# Altium project HabitSunrise.PrjPcb
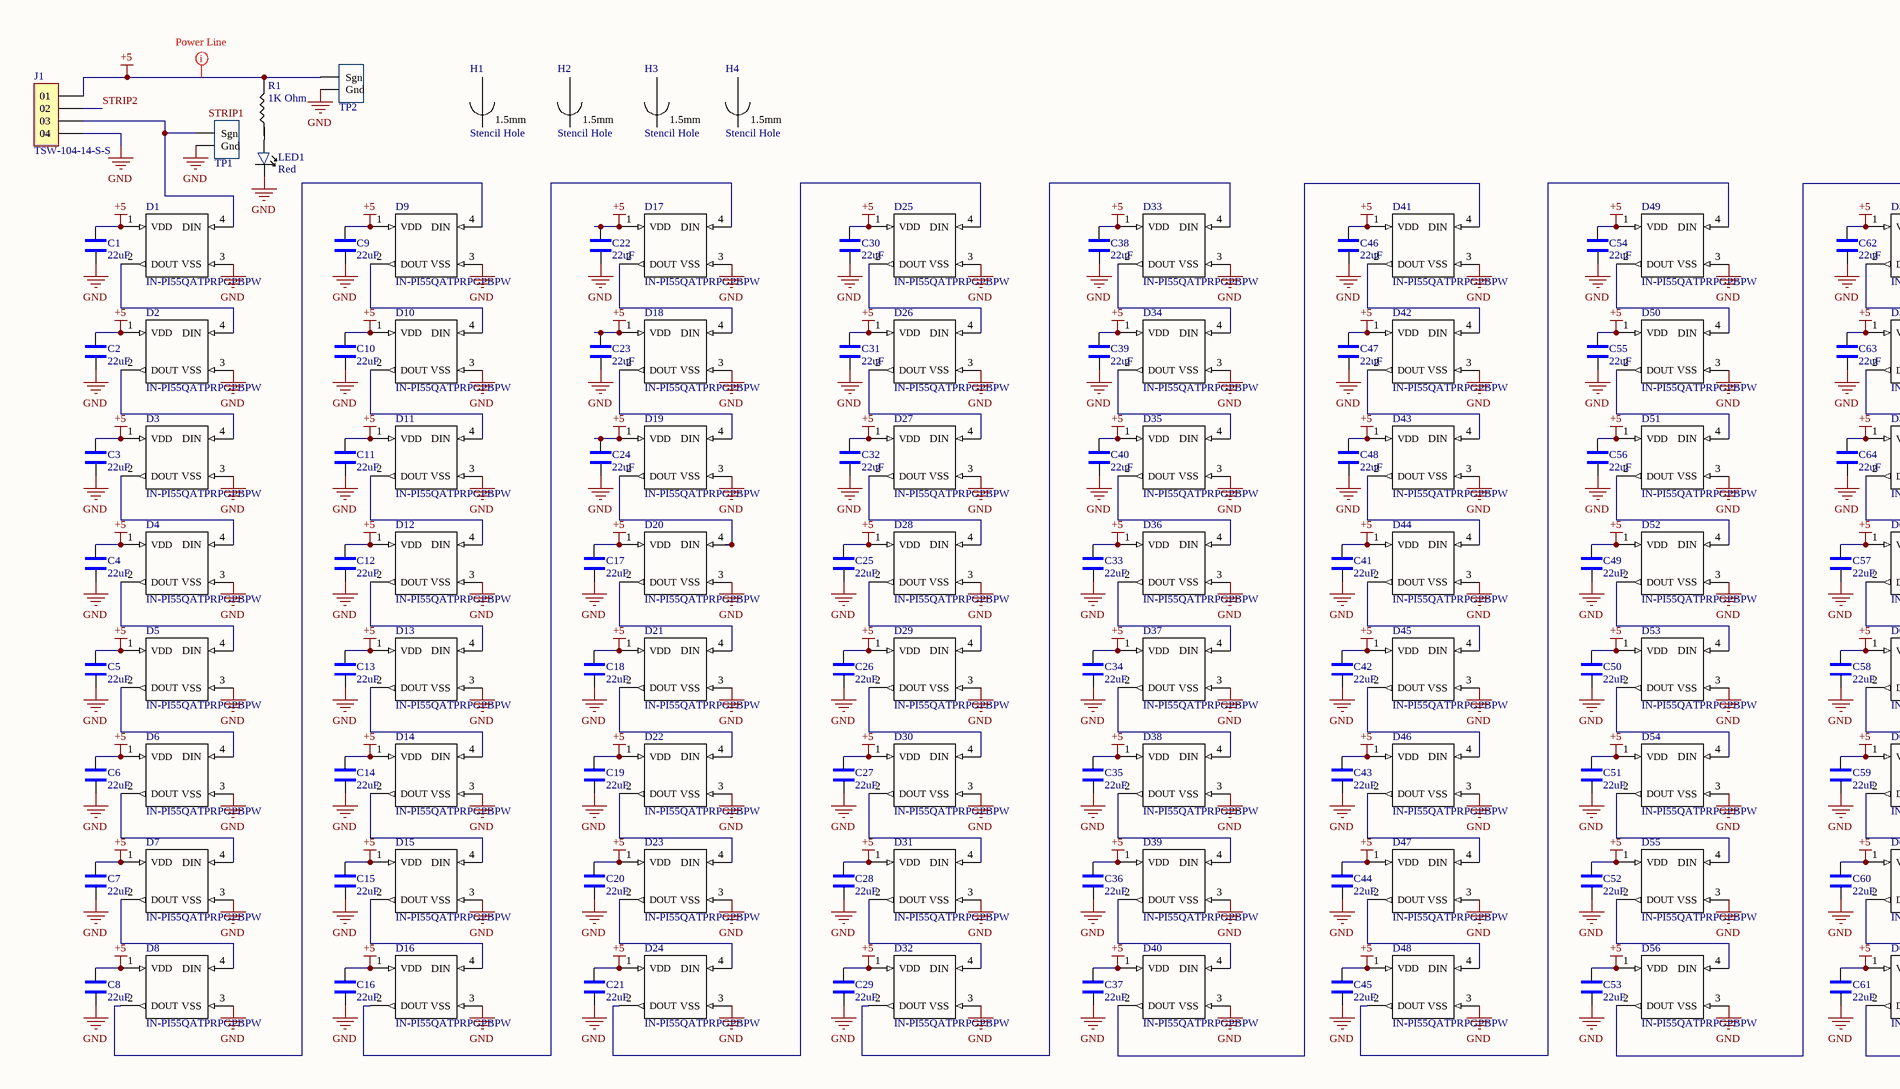
[diagram p0: SmartLEDS.SchDoc, left]
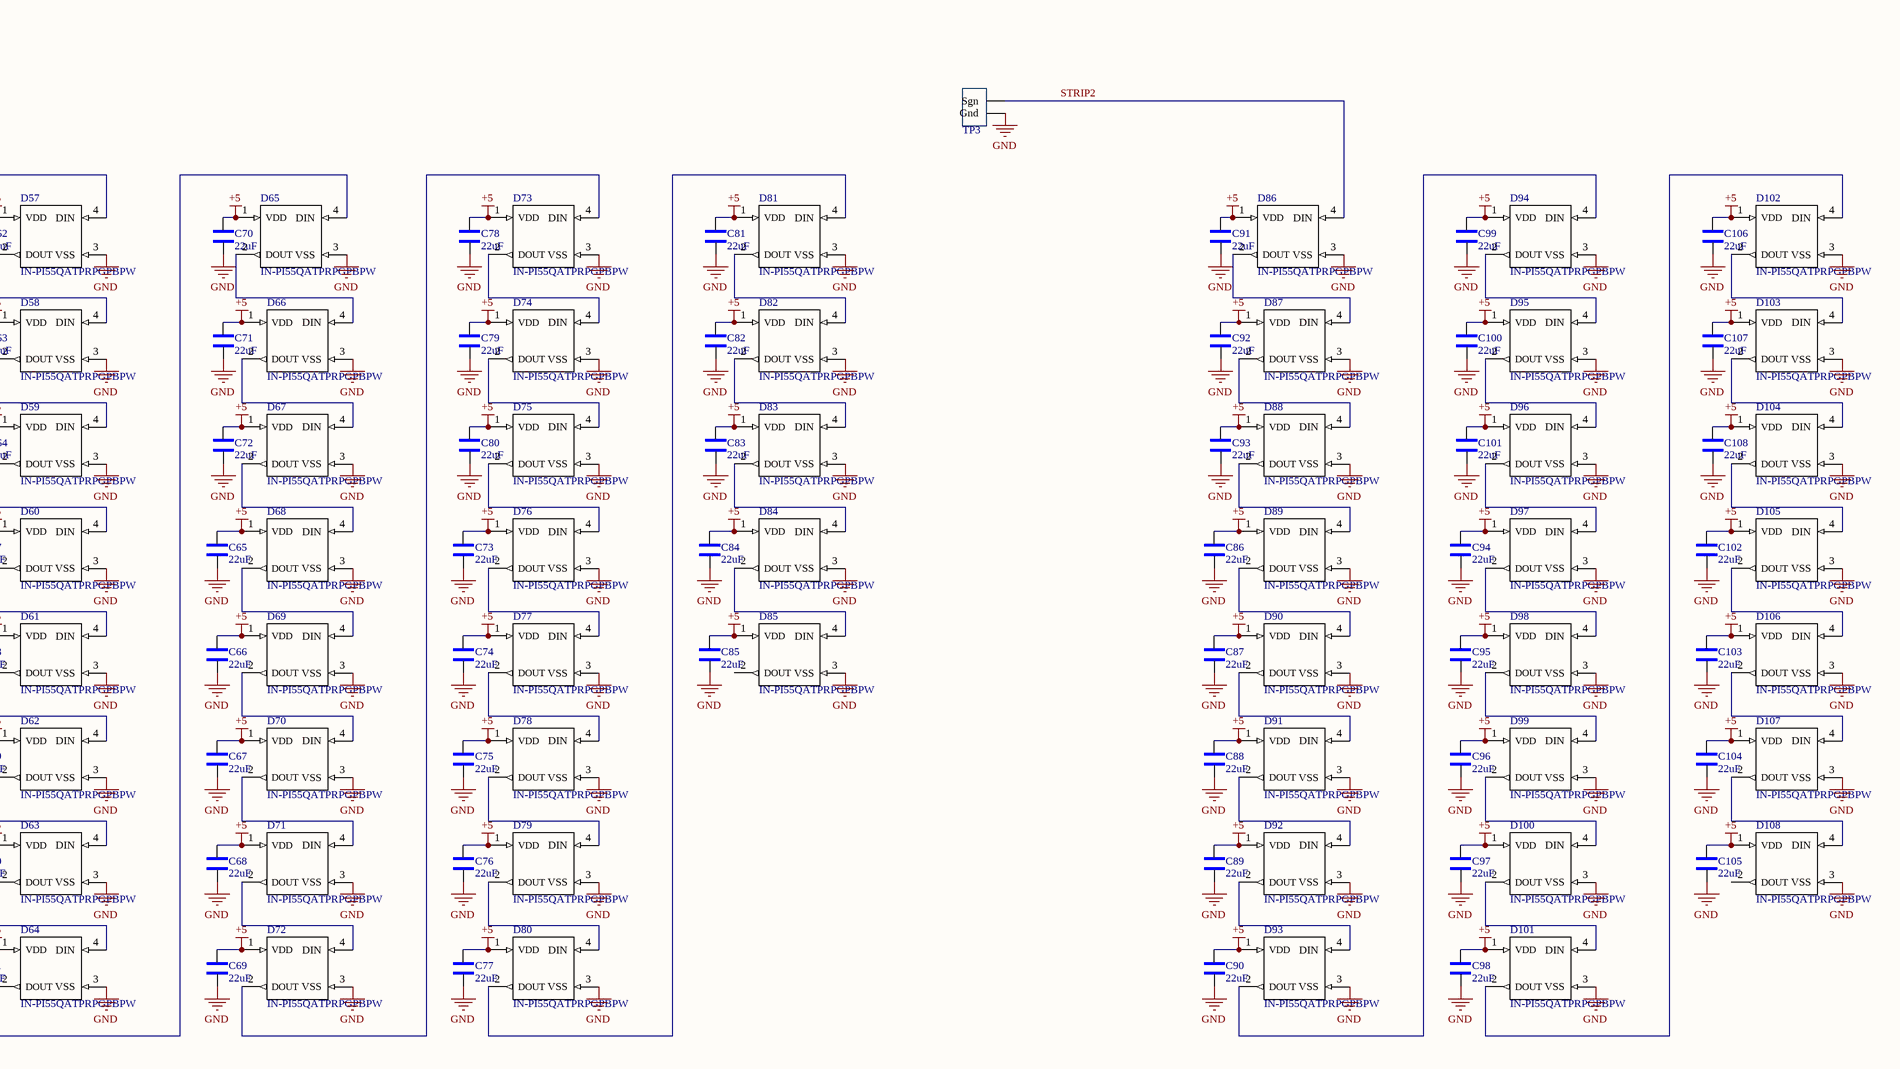
[diagram p1: SmartLEDS.SchDoc, right]
1 sheet, 226 parts. Net scope: global (net labels, ports and power ports of the same name join across sheets).
Board file: LED.PcbDoc

## Sheet SmartLEDS.SchDoc
size 1143 x 241 mm; SheetNumber: 1; SheetTotal: 1

### Parts
C1  22uF  [1206_Passive_Capacitor]
C2  22uF  [1206_Passive_Capacitor]
C3  22uF  [1206_Passive_Capacitor]
C4  22uF  [1206_Passive_Capacitor]
C5  22uF  [1206_Passive_Capacitor]
C6  22uF  [1206_Passive_Capacitor]
C7  22uF  [1206_Passive_Capacitor]
C8  22uF  [1206_Passive_Capacitor]
C9  22uF  [1206_Passive_Capacitor]
C10  22uF  [1206_Passive_Capacitor]
C11  22uF  [1206_Passive_Capacitor]
C12  22uF  [1206_Passive_Capacitor]
C13  22uF  [1206_Passive_Capacitor]
C14  22uF  [1206_Passive_Capacitor]
C15  22uF  [1206_Passive_Capacitor]
C16  22uF  [1206_Passive_Capacitor]
C17  22uF  [1206_Passive_Capacitor]
C18  22uF  [1206_Passive_Capacitor]
C19  22uF  [1206_Passive_Capacitor]
C20  22uF  [1206_Passive_Capacitor]
C21  22uF  [1206_Passive_Capacitor]
C22  22uF  [1206_Passive_Capacitor]
C23  22uF  [1206_Passive_Capacitor]
C24  22uF  [1206_Passive_Capacitor]
C25  22uF  [1206_Passive_Capacitor]
C26  22uF  [1206_Passive_Capacitor]
C27  22uF  [1206_Passive_Capacitor]
C28  22uF  [1206_Passive_Capacitor]
C29  22uF  [1206_Passive_Capacitor]
C30  22uF  [1206_Passive_Capacitor]
C31  22uF  [1206_Passive_Capacitor]
C32  22uF  [1206_Passive_Capacitor]
C33  22uF  [1206_Passive_Capacitor]
C34  22uF  [1206_Passive_Capacitor]
C35  22uF  [1206_Passive_Capacitor]
C36  22uF  [1206_Passive_Capacitor]
C37  22uF  [1206_Passive_Capacitor]
C38  22uF  [1206_Passive_Capacitor]
C39  22uF  [1206_Passive_Capacitor]
C40  22uF  [1206_Passive_Capacitor]
C41  22uF  [1206_Passive_Capacitor]
C42  22uF  [1206_Passive_Capacitor]
C43  22uF  [1206_Passive_Capacitor]
C44  22uF  [1206_Passive_Capacitor]
C45  22uF  [1206_Passive_Capacitor]
C46  22uF  [1206_Passive_Capacitor]
C47  22uF  [1206_Passive_Capacitor]
C48  22uF  [1206_Passive_Capacitor]
C49  22uF  [1206_Passive_Capacitor]
C50  22uF  [1206_Passive_Capacitor]
C51  22uF  [1206_Passive_Capacitor]
C52  22uF  [1206_Passive_Capacitor]
C53  22uF  [1206_Passive_Capacitor]
C54  22uF  [1206_Passive_Capacitor]
C55  22uF  [1206_Passive_Capacitor]
C56  22uF  [1206_Passive_Capacitor]
C57  22uF  [1206_Passive_Capacitor]
C58  22uF  [1206_Passive_Capacitor]
C59  22uF  [1206_Passive_Capacitor]
C60  22uF  [1206_Passive_Capacitor]
C61  22uF  [1206_Passive_Capacitor]
C62  22uF  [1206_Passive_Capacitor]
C63  22uF  [1206_Passive_Capacitor]
C64  22uF  [1206_Passive_Capacitor]
C65  22uF  [1206_Passive_Capacitor]
C66  22uF  [1206_Passive_Capacitor]
C67  22uF  [1206_Passive_Capacitor]
C68  22uF  [1206_Passive_Capacitor]
C69  22uF  [1206_Passive_Capacitor]
C70  22uF  [1206_Passive_Capacitor]
C71  22uF  [1206_Passive_Capacitor]
C72  22uF  [1206_Passive_Capacitor]
C73  22uF  [1206_Passive_Capacitor]
C74  22uF  [1206_Passive_Capacitor]
C75  22uF  [1206_Passive_Capacitor]
C76  22uF  [1206_Passive_Capacitor]
C77  22uF  [1206_Passive_Capacitor]
C78  22uF  [1206_Passive_Capacitor]
C79  22uF  [1206_Passive_Capacitor]
C80  22uF  [1206_Passive_Capacitor]
C81  22uF  [1206_Passive_Capacitor]
C82  22uF  [1206_Passive_Capacitor]
C83  22uF  [1206_Passive_Capacitor]
C84  22uF  [1206_Passive_Capacitor]
C85  22uF  [1206_Passive_Capacitor]
C86  22uF  [1206_Passive_Capacitor]
C87  22uF  [1206_Passive_Capacitor]
C88  22uF  [1206_Passive_Capacitor]
C89  22uF  [1206_Passive_Capacitor]
C90  22uF  [1206_Passive_Capacitor]
C91  22uF  [1206_Passive_Capacitor]
C92  22uF  [1206_Passive_Capacitor]
C93  22uF  [1206_Passive_Capacitor]
C94  22uF  [1206_Passive_Capacitor]
C95  22uF  [1206_Passive_Capacitor]
C96  22uF  [1206_Passive_Capacitor]
C97  22uF  [1206_Passive_Capacitor]
C98  22uF  [1206_Passive_Capacitor]
C99  22uF  [1206_Passive_Capacitor]
C100  22uF  [1206_Passive_Capacitor]
C101  22uF  [1206_Passive_Capacitor]
C102  22uF  [1206_Passive_Capacitor]
C103  22uF  [1206_Passive_Capacitor]
C104  22uF  [1206_Passive_Capacitor]
C105  22uF  [1206_Passive_Capacitor]
C106  22uF  [1206_Passive_Capacitor]
C107  22uF  [1206_Passive_Capacitor]
C108  22uF  [1206_Passive_Capacitor]
D1  IN-PI55QATPRPGPBPW  [SERIAL_LED - duplicate]
D2  IN-PI55QATPRPGPBPW  [SERIAL_LED - duplicate]
D3  IN-PI55QATPRPGPBPW  [SERIAL_LED - duplicate]
D4  IN-PI55QATPRPGPBPW  [SERIAL_LED - duplicate]
D5  IN-PI55QATPRPGPBPW  [SERIAL_LED - duplicate]
D6  IN-PI55QATPRPGPBPW  [SERIAL_LED - duplicate]
D7  IN-PI55QATPRPGPBPW  [SERIAL_LED - duplicate]
D8  IN-PI55QATPRPGPBPW  [SERIAL_LED - duplicate]
D9  IN-PI55QATPRPGPBPW  [SERIAL_LED - duplicate]
D10  IN-PI55QATPRPGPBPW  [SERIAL_LED - duplicate]
D11  IN-PI55QATPRPGPBPW  [SERIAL_LED - duplicate]
D12  IN-PI55QATPRPGPBPW  [SERIAL_LED - duplicate]
D13  IN-PI55QATPRPGPBPW  [SERIAL_LED - duplicate]
D14  IN-PI55QATPRPGPBPW  [SERIAL_LED - duplicate]
D15  IN-PI55QATPRPGPBPW  [SERIAL_LED - duplicate]
D16  IN-PI55QATPRPGPBPW  [SERIAL_LED - duplicate]
D17  IN-PI55QATPRPGPBPW  [SERIAL_LED - duplicate]
D18  IN-PI55QATPRPGPBPW  [SERIAL_LED - duplicate]
D19  IN-PI55QATPRPGPBPW  [SERIAL_LED - duplicate]
D20  IN-PI55QATPRPGPBPW  [SERIAL_LED - duplicate]
D21  IN-PI55QATPRPGPBPW  [SERIAL_LED - duplicate]
D22  IN-PI55QATPRPGPBPW  [SERIAL_LED - duplicate]
D23  IN-PI55QATPRPGPBPW  [SERIAL_LED - duplicate]
D24  IN-PI55QATPRPGPBPW  [SERIAL_LED - duplicate]
D25  IN-PI55QATPRPGPBPW  [SERIAL_LED - duplicate]
D26  IN-PI55QATPRPGPBPW  [SERIAL_LED - duplicate]
D27  IN-PI55QATPRPGPBPW  [SERIAL_LED - duplicate]
D28  IN-PI55QATPRPGPBPW  [SERIAL_LED - duplicate]
D29  IN-PI55QATPRPGPBPW  [SERIAL_LED - duplicate]
D30  IN-PI55QATPRPGPBPW  [SERIAL_LED - duplicate]
D31  IN-PI55QATPRPGPBPW  [SERIAL_LED - duplicate]
D32  IN-PI55QATPRPGPBPW  [SERIAL_LED - duplicate]
D33  IN-PI55QATPRPGPBPW  [SERIAL_LED - duplicate]
D34  IN-PI55QATPRPGPBPW  [SERIAL_LED - duplicate]
D35  IN-PI55QATPRPGPBPW  [SERIAL_LED - duplicate]
D36  IN-PI55QATPRPGPBPW  [SERIAL_LED - duplicate]
D37  IN-PI55QATPRPGPBPW  [SERIAL_LED - duplicate]
D38  IN-PI55QATPRPGPBPW  [SERIAL_LED - duplicate]
D39  IN-PI55QATPRPGPBPW  [SERIAL_LED - duplicate]
D40  IN-PI55QATPRPGPBPW  [SERIAL_LED - duplicate]
D41  IN-PI55QATPRPGPBPW  [SERIAL_LED - duplicate]
D42  IN-PI55QATPRPGPBPW  [SERIAL_LED - duplicate]
D43  IN-PI55QATPRPGPBPW  [SERIAL_LED - duplicate]
D44  IN-PI55QATPRPGPBPW  [SERIAL_LED - duplicate]
D45  IN-PI55QATPRPGPBPW  [SERIAL_LED - duplicate]
D46  IN-PI55QATPRPGPBPW  [SERIAL_LED - duplicate]
D47  IN-PI55QATPRPGPBPW  [SERIAL_LED - duplicate]
D48  IN-PI55QATPRPGPBPW  [SERIAL_LED - duplicate]
D49  IN-PI55QATPRPGPBPW  [SERIAL_LED - duplicate]
D50  IN-PI55QATPRPGPBPW  [SERIAL_LED - duplicate]
D51  IN-PI55QATPRPGPBPW  [SERIAL_LED - duplicate]
D52  IN-PI55QATPRPGPBPW  [SERIAL_LED - duplicate]
D53  IN-PI55QATPRPGPBPW  [SERIAL_LED - duplicate]
D54  IN-PI55QATPRPGPBPW  [SERIAL_LED - duplicate]
D55  IN-PI55QATPRPGPBPW  [SERIAL_LED - duplicate]
D56  IN-PI55QATPRPGPBPW  [SERIAL_LED - duplicate]
D57  IN-PI55QATPRPGPBPW  [SERIAL_LED - duplicate]
D58  IN-PI55QATPRPGPBPW  [SERIAL_LED - duplicate]
D59  IN-PI55QATPRPGPBPW  [SERIAL_LED - duplicate]
D60  IN-PI55QATPRPGPBPW  [SERIAL_LED - duplicate]
D61  IN-PI55QATPRPGPBPW  [SERIAL_LED - duplicate]
D62  IN-PI55QATPRPGPBPW  [SERIAL_LED - duplicate]
D63  IN-PI55QATPRPGPBPW  [SERIAL_LED - duplicate]
D64  IN-PI55QATPRPGPBPW  [SERIAL_LED - duplicate]
D65  IN-PI55QATPRPGPBPW  [SERIAL_LED - duplicate]
D66  IN-PI55QATPRPGPBPW  [SERIAL_LED - duplicate]
D67  IN-PI55QATPRPGPBPW  [SERIAL_LED - duplicate]
D68  IN-PI55QATPRPGPBPW  [SERIAL_LED - duplicate]
D69  IN-PI55QATPRPGPBPW  [SERIAL_LED - duplicate]
D70  IN-PI55QATPRPGPBPW  [SERIAL_LED - duplicate]
D71  IN-PI55QATPRPGPBPW  [SERIAL_LED - duplicate]
D72  IN-PI55QATPRPGPBPW  [SERIAL_LED - duplicate]
D73  IN-PI55QATPRPGPBPW  [SERIAL_LED - duplicate]
D74  IN-PI55QATPRPGPBPW  [SERIAL_LED - duplicate]
D75  IN-PI55QATPRPGPBPW  [SERIAL_LED - duplicate]
D76  IN-PI55QATPRPGPBPW  [SERIAL_LED - duplicate]
D77  IN-PI55QATPRPGPBPW  [SERIAL_LED - duplicate]
D78  IN-PI55QATPRPGPBPW  [SERIAL_LED - duplicate]
D79  IN-PI55QATPRPGPBPW  [SERIAL_LED - duplicate]
D80  IN-PI55QATPRPGPBPW  [SERIAL_LED - duplicate]
D81  IN-PI55QATPRPGPBPW  [SERIAL_LED - duplicate]
D82  IN-PI55QATPRPGPBPW  [SERIAL_LED - duplicate]
D83  IN-PI55QATPRPGPBPW  [SERIAL_LED - duplicate]
D84  IN-PI55QATPRPGPBPW  [SERIAL_LED - duplicate]
D85  IN-PI55QATPRPGPBPW  [SERIAL_LED - duplicate]
D86  IN-PI55QATPRPGPBPW  [SERIAL_LED - duplicate]
D87  IN-PI55QATPRPGPBPW  [SERIAL_LED - duplicate]
D88  IN-PI55QATPRPGPBPW  [SERIAL_LED - duplicate]
D89  IN-PI55QATPRPGPBPW  [SERIAL_LED - duplicate]
D90  IN-PI55QATPRPGPBPW  [SERIAL_LED - duplicate]
D91  IN-PI55QATPRPGPBPW  [SERIAL_LED - duplicate]
D92  IN-PI55QATPRPGPBPW  [SERIAL_LED - duplicate]
D93  IN-PI55QATPRPGPBPW  [SERIAL_LED - duplicate]
D94  IN-PI55QATPRPGPBPW  [SERIAL_LED - duplicate]
D95  IN-PI55QATPRPGPBPW  [SERIAL_LED - duplicate]
D96  IN-PI55QATPRPGPBPW  [SERIAL_LED - duplicate]
D97  IN-PI55QATPRPGPBPW  [SERIAL_LED - duplicate]
D98  IN-PI55QATPRPGPBPW  [SERIAL_LED - duplicate]
D99  IN-PI55QATPRPGPBPW  [SERIAL_LED - duplicate]
D100  IN-PI55QATPRPGPBPW  [SERIAL_LED - duplicate]
D101  IN-PI55QATPRPGPBPW  [SERIAL_LED - duplicate]
D102  IN-PI55QATPRPGPBPW  [SERIAL_LED - duplicate]
D103  IN-PI55QATPRPGPBPW  [SERIAL_LED - duplicate]
D104  IN-PI55QATPRPGPBPW  [SERIAL_LED - duplicate]
D105  IN-PI55QATPRPGPBPW  [SERIAL_LED - duplicate]
D106  IN-PI55QATPRPGPBPW  [SERIAL_LED - duplicate]
D107  IN-PI55QATPRPGPBPW  [SERIAL_LED - duplicate]
D108  IN-PI55QATPRPGPBPW  [SERIAL_LED - duplicate]
H1  Stencil Hole  [AlignmentHole_1.5mm]
H2  Stencil Hole  [AlignmentHole_1.5mm]
H3  Stencil Hole  [AlignmentHole_1.5mm]
H4  Stencil Hole  [AlignmentHole_1.5mm]
J1  TSW-104-14-S-S  [JM-4_TSW-104-14-S-S]
LED1  Red  [LED_1206]
R1  value 1K Ohm  [1206_Passive_Resitor]  (hidden comment: 1k)
TP1  10x Probe TP  [TP10x_Probe]  (value not drawn)
TP2  10x Probe TP  [TP10x_Probe]  (value not drawn)
TP3  10x Probe TP  [TP10x_Probe]  (value not drawn)

### Nets
+5: C1.2 C2.2 C3.2 C4.2 C5.2 C6.2 C7.2 C8.2 C9.2 C10.2 C11.2 C12.2 C13.2 C14.2 C15.2 C16.2 C17.2 C18.2 C19.2 C20.2 C21.2 C22.2 C23.2 C24.2 C25.2 C26.2 C27.2 C28.2 C29.2 C30.2 C31.2 C32.2 C33.2 C34.2 C35.2 C36.2 C37.2 C38.2 C39.2 C40.2 C41.2 C42.2 C43.2 C44.2 C45.2 C46.2 C47.2 C48.2 C49.2 C50.2 C51.2 C52.2 C53.2 C54.2 C55.2 C56.2 C57.2 C58.2 C59.2 C60.2 C61.2 C62.2 C63.2 C64.2 C65.2 C66.2 C67.2 C68.2 C69.2 C70.2 C71.2 C72.2 C73.2 C74.2 C75.2 C76.2 C77.2 C78.2 C79.2 C80.2 C81.2 C82.2 C83.2 C84.2 C85.2 C86.2 C87.2 C88.2 C89.2 C90.2 C91.2 C92.2 C93.2 C94.2 C95.2 C96.2 C97.2 C98.2 C99.2 C100.2 C101.2 C102.2 C103.2 C104.2 C105.2 C106.2 C107.2 C108.2 D1.1(VDD) D2.1(VDD) D3.1(VDD) D4.1(VDD) D5.1(VDD) D6.1(VDD) D7.1(VDD) D8.1(VDD) D9.1(VDD) D10.1(VDD) D11.1(VDD) D12.1(VDD) D13.1(VDD) D14.1(VDD) D15.1(VDD) D16.1(VDD) D17.1(VDD) D18.1(VDD) D19.1(VDD) D20.1(VDD) D21.1(VDD) D22.1(VDD) D23.1(VDD) D24.1(VDD) D25.1(VDD) D26.1(VDD) D27.1(VDD) D28.1(VDD) D29.1(VDD) D30.1(VDD) D31.1(VDD) D32.1(VDD) D33.1(VDD) D34.1(VDD) D35.1(VDD) D36.1(VDD) D37.1(VDD) D38.1(VDD) D39.1(VDD) D40.1(VDD) D41.1(VDD) D42.1(VDD) D43.1(VDD) D44.1(VDD) D45.1(VDD) D46.1(VDD) D47.1(VDD) D48.1(VDD) D49.1(VDD) D50.1(VDD) D51.1(VDD) D52.1(VDD) D53.1(VDD) D54.1(VDD) D55.1(VDD) D56.1(VDD) D57.1(VDD) D58.1(VDD) D59.1(VDD) D60.1(VDD) D61.1(VDD) D62.1(VDD) D63.1(VDD) D64.1(VDD) D65.1(VDD) D66.1(VDD) D67.1(VDD) D68.1(VDD) D69.1(VDD) D70.1(VDD) D71.1(VDD) D72.1(VDD) D73.1(VDD) D74.1(VDD) D75.1(VDD) D76.1(VDD) D77.1(VDD) D78.1(VDD) D79.1(VDD) D80.1(VDD) D81.1(VDD) D82.1(VDD) D83.1(VDD) D84.1(VDD) D85.1(VDD) D86.1(VDD) D87.1(VDD) D88.1(VDD) D89.1(VDD) D90.1(VDD) D91.1(VDD) D92.1(VDD) D93.1(VDD) D94.1(VDD) D95.1(VDD) D96.1(VDD) D97.1(VDD) D98.1(VDD) D99.1(VDD) D100.1(VDD) D101.1(VDD) D102.1(VDD) D103.1(VDD) D104.1(VDD) D105.1(VDD) D106.1(VDD) D107.1(VDD) D108.1(VDD) J1.01 R1.2 TP2.1(Sgn)
GND: C1.1 C2.1 C3.1 C4.1 C5.1 C6.1 C7.1 C8.1 C9.1 C10.1 C11.1 C12.1 C13.1 C14.1 C15.1 C16.1 C17.1 C18.1 C19.1 C20.1 C21.1 C22.1 C23.1 C24.1 C25.1 C26.1 C27.1 C28.1 C29.1 C30.1 C31.1 C32.1 C33.1 C34.1 C35.1 C36.1 C37.1 C38.1 C39.1 C40.1 C41.1 C42.1 C43.1 C44.1 C45.1 C46.1 C47.1 C48.1 C49.1 C50.1 C51.1 C52.1 C53.1 C54.1 C55.1 C56.1 C57.1 C58.1 C59.1 C60.1 C61.1 C62.1 C63.1 C64.1 C65.1 C66.1 C67.1 C68.1 C69.1 C70.1 C71.1 C72.1 C73.1 C74.1 C75.1 C76.1 C77.1 C78.1 C79.1 C80.1 C81.1 C82.1 C83.1 C84.1 C85.1 C86.1 C87.1 C88.1 C89.1 C90.1 C91.1 C92.1 C93.1 C94.1 C95.1 C96.1 C97.1 C98.1 C99.1 C100.1 C101.1 C102.1 C103.1 C104.1 C105.1 C106.1 C107.1 C108.1 D1.3(VSS) D2.3(VSS) D3.3(VSS) D4.3(VSS) D5.3(VSS) D6.3(VSS) D7.3(VSS) D8.3(VSS) D9.3(VSS) D10.3(VSS) D11.3(VSS) D12.3(VSS) D13.3(VSS) D14.3(VSS) D15.3(VSS) D16.3(VSS) D17.3(VSS) D18.3(VSS) D19.3(VSS) D20.3(VSS) D21.3(VSS) D22.3(VSS) D23.3(VSS) D24.3(VSS) D25.3(VSS) D26.3(VSS) D27.3(VSS) D28.3(VSS) D29.3(VSS) D30.3(VSS) D31.3(VSS) D32.3(VSS) D33.3(VSS) D34.3(VSS) D35.3(VSS) D36.3(VSS) D37.3(VSS) D38.3(VSS) D39.3(VSS) D40.3(VSS) D41.3(VSS) D42.3(VSS) D43.3(VSS) D44.3(VSS) D45.3(VSS) D46.3(VSS) D47.3(VSS) D48.3(VSS) D49.3(VSS) D50.3(VSS) D51.3(VSS) D52.3(VSS) D53.3(VSS) D54.3(VSS) D55.3(VSS) D56.3(VSS) D57.3(VSS) D58.3(VSS) D59.3(VSS) D60.3(VSS) D61.3(VSS) D62.3(VSS) D63.3(VSS) D64.3(VSS) D65.3(VSS) D66.3(VSS) D67.3(VSS) D68.3(VSS) D69.3(VSS) D70.3(VSS) D71.3(VSS) D72.3(VSS) D73.3(VSS) D74.3(VSS) D75.3(VSS) D76.3(VSS) D77.3(VSS) D78.3(VSS) D79.3(VSS) D80.3(VSS) D81.3(VSS) D82.3(VSS) D83.3(VSS) D84.3(VSS) D85.3(VSS) D86.3(VSS) D87.3(VSS) D88.3(VSS) D89.3(VSS) D90.3(VSS) D91.3(VSS) D92.3(VSS) D93.3(VSS) D94.3(VSS) D95.3(VSS) D96.3(VSS) D97.3(VSS) D98.3(VSS) D99.3(VSS) D100.3(VSS) D101.3(VSS) D102.3(VSS) D103.3(VSS) D104.3(VSS) D105.3(VSS) D106.3(VSS) D107.3(VSS) D108.3(VSS) J1.04 LED1.2 TP1.2(Gnd) TP2.2(Gnd) TP3.2(Gnd)
STRIP2: D86.4(DIN) J1.02 TP3.1(Sgn)
NetD1_2: D1.2(DOUT) D2.4(DIN)
NetD1_4: D1.4(DIN) J1.03 TP1.1(Sgn)
NetD2_2: D2.2(DOUT) D3.4(DIN)
NetD3_2: D3.2(DOUT) D4.4(DIN)
NetD4_2: D4.2(DOUT) D5.4(DIN)
NetD5_2: D5.2(DOUT) D6.4(DIN)
NetD6_2: D6.2(DOUT) D7.4(DIN)
NetD7_2: D7.2(DOUT) D8.4(DIN)
NetD8_2: D8.2(DOUT) D9.4(DIN)
NetD9_2: D9.2(DOUT) D10.4(DIN)
NetD10_2: D10.2(DOUT) D11.4(DIN)
NetD11_2: D11.2(DOUT) D12.4(DIN)
NetD12_2: D12.2(DOUT) D13.4(DIN)
NetD13_2: D13.2(DOUT) D14.4(DIN)
NetD14_2: D14.2(DOUT) D15.4(DIN)
NetD15_2: D15.2(DOUT) D16.4(DIN)
NetD16_2: D16.2(DOUT) D17.4(DIN)
NetD17_2: D17.2(DOUT) D18.4(DIN)
NetD18_2: D18.2(DOUT) D19.4(DIN)
NetD19_2: D19.2(DOUT) D20.4(DIN)
NetD20_2: D20.2(DOUT) D21.4(DIN)
NetD21_2: D21.2(DOUT) D22.4(DIN)
NetD22_2: D22.2(DOUT) D23.4(DIN)
NetD23_2: D23.2(DOUT) D24.4(DIN)
NetD24_2: D24.2(DOUT) D25.4(DIN)
NetD25_2: D25.2(DOUT) D26.4(DIN)
NetD26_2: D26.2(DOUT) D27.4(DIN)
NetD27_2: D27.2(DOUT) D28.4(DIN)
NetD28_2: D28.2(DOUT) D29.4(DIN)
NetD29_2: D29.2(DOUT) D30.4(DIN)
NetD30_2: D30.2(DOUT) D31.4(DIN)
NetD31_2: D31.2(DOUT) D32.4(DIN)
NetD32_2: D32.2(DOUT) D33.4(DIN)
NetD33_2: D33.2(DOUT) D34.4(DIN)
NetD34_2: D34.2(DOUT) D35.4(DIN)
NetD35_2: D35.2(DOUT) D36.4(DIN)
NetD36_2: D36.2(DOUT) D37.4(DIN)
NetD37_2: D37.2(DOUT) D38.4(DIN)
NetD38_2: D38.2(DOUT) D39.4(DIN)
NetD39_2: D39.2(DOUT) D40.4(DIN)
NetD40_2: D40.2(DOUT) D41.4(DIN)
NetD41_2: D41.2(DOUT) D42.4(DIN)
NetD42_2: D42.2(DOUT) D43.4(DIN)
NetD43_2: D43.2(DOUT) D44.4(DIN)
NetD44_2: D44.2(DOUT) D45.4(DIN)
NetD45_2: D45.2(DOUT) D46.4(DIN)
NetD46_2: D46.2(DOUT) D47.4(DIN)
NetD47_2: D47.2(DOUT) D48.4(DIN)
NetD48_2: D48.2(DOUT) D49.4(DIN)
NetD49_2: D49.2(DOUT) D50.4(DIN)
NetD50_2: D50.2(DOUT) D51.4(DIN)
NetD51_2: D51.2(DOUT) D52.4(DIN)
NetD52_2: D52.2(DOUT) D53.4(DIN)
NetD53_2: D53.2(DOUT) D54.4(DIN)
NetD54_2: D54.2(DOUT) D55.4(DIN)
NetD55_2: D55.2(DOUT) D56.4(DIN)
NetD56_2: D56.2(DOUT) D57.4(DIN)
NetD57_2: D57.2(DOUT) D58.4(DIN)
NetD58_2: D58.2(DOUT) D59.4(DIN)
NetD59_2: D59.2(DOUT) D60.4(DIN)
NetD60_2: D60.2(DOUT) D61.4(DIN)
NetD61_2: D61.2(DOUT) D62.4(DIN)
NetD62_2: D62.2(DOUT) D63.4(DIN)
NetD63_2: D63.2(DOUT) D64.4(DIN)
NetD64_2: D64.2(DOUT) D65.4(DIN)
NetD65_2: D65.2(DOUT) D66.4(DIN)
NetD66_2: D66.2(DOUT) D67.4(DIN)
NetD67_2: D67.2(DOUT) D68.4(DIN)
NetD68_2: D68.2(DOUT) D69.4(DIN)
NetD69_2: D69.2(DOUT) D70.4(DIN)
NetD70_2: D70.2(DOUT) D71.4(DIN)
NetD71_2: D71.2(DOUT) D72.4(DIN)
NetD72_2: D72.2(DOUT) D73.4(DIN)
NetD73_2: D73.2(DOUT) D74.4(DIN)
NetD74_2: D74.2(DOUT) D75.4(DIN)
NetD75_2: D75.2(DOUT) D76.4(DIN)
NetD76_2: D76.2(DOUT) D77.4(DIN)
NetD77_2: D77.2(DOUT) D78.4(DIN)
NetD78_2: D78.2(DOUT) D79.4(DIN)
NetD79_2: D79.2(DOUT) D80.4(DIN)
NetD80_2: D80.2(DOUT) D81.4(DIN)
NetD81_2: D81.2(DOUT) D82.4(DIN)
NetD82_2: D82.2(DOUT) D83.4(DIN)
NetD83_2: D83.2(DOUT) D84.4(DIN)
NetD84_2: D84.2(DOUT) D85.4(DIN)
NetD86_2: D86.2(DOUT) D87.4(DIN)
NetD87_2: D87.2(DOUT) D88.4(DIN)
NetD88_2: D88.2(DOUT) D89.4(DIN)
NetD89_2: D89.2(DOUT) D90.4(DIN)
NetD90_2: D90.2(DOUT) D91.4(DIN)
NetD91_2: D91.2(DOUT) D92.4(DIN)
NetD92_2: D92.2(DOUT) D93.4(DIN)
NetD93_2: D93.2(DOUT) D94.4(DIN)
NetD94_2: D94.2(DOUT) D95.4(DIN)
NetD95_2: D95.2(DOUT) D96.4(DIN)
NetD96_2: D96.2(DOUT) D97.4(DIN)
NetD97_2: D97.2(DOUT) D98.4(DIN)
NetD98_2: D98.2(DOUT) D99.4(DIN)
NetD99_2: D99.2(DOUT) D100.4(DIN)
NetD100_2: D100.2(DOUT) D101.4(DIN)
NetD101_2: D101.2(DOUT) D102.4(DIN)
NetD102_2: D102.2(DOUT) D103.4(DIN)
NetD103_2: D103.2(DOUT) D104.4(DIN)
NetD104_2: D104.2(DOUT) D105.4(DIN)
NetD105_2: D105.2(DOUT) D106.4(DIN)
NetD106_2: D106.2(DOUT) D107.4(DIN)
NetD107_2: D107.2(DOUT) D108.4(DIN)
NetLED1_1: LED1.1 R1.1

Not connected (* = marked no-connect by the designer): D85 2(DOUT); D108 2(DOUT)

### Layout directives
rule Width Constraint [Pref Width = 20mil    Min Width = 10mil    Max Width = 20mil]: +5

### Notes on the sheet
- Labels drawn without touching a wire or pin: STRIP1
- (in symbol H_StencilAllignment_1.5mm) 1.5mm

### Library data of the parts
C1-C108 = C_22uF_1206: 22uF ±10% 25V X5R 1206 Multilayer Ceramic Capacitors MLCC - SMD/SMT RoHS; MFR Part #: CL31A226KAHNNNE; Type: basic; LCSC Part#: C12891; Datasheet: https://datasheet.lcsc.com/lcsc/1811031514_Samsung-Electro-Mechanics-CL31A226KAHNNNE_C12891.pdf; Value: 22uF
D1-D108 = LED_Smart: LIGHT EMITTING DIODES (LED) RGB 620~630NM RED, 520~530NM GREEN, 465~475NM BLUE 600MCD@16MARED,1200MCD@16MAGREEN,300MCD@16MABLUE TOP VIEW SMD-4 ROHS; MFR Part #: XL-5050RGBC-WS2812B; Manufacturer: XINGLIGHT; LCSC Part#: C2843785; DataSheet: https://datasheet.lcsc.com/lcsc/2301111130_XINGLIGHT-XL-5050RGBC-WS2812B_C2843785.pdf
H1-H4 = H_StencilAllignment_1.5mm: Stencil Allignment hole for use with 1.5mm pin
J1 = JM_4_PIN_MALE: Square Pins 2.5mm 6mm -40℃~+105℃ 1 4 3mm 2.54mm Black 1x4P Straight,P=2.54mm  Pin Headers ROHS; MFR PART #: PZ254V-11-04P; MP: TSW-104-14-S-S; LCSC PART#: C2691448
LED1 = LED_RED_1206: Red 621~631nm 1206 Light Emitting Diodes (LED) RoHS; MFR Part #: 15-21/R6C-FQ1R1B/2T; Type: Extended; LCSC Part#: C93133; Datasheet: https://datasheet.lcsc.com/szlcsc/1811151241_Everlight-Elec-15-21-R6C-FQ1R1B-2T_C93133.pdf; Value: Red
R1 = R_1K_1206: CHIP RESISTOR - SURFACE MOUNT 1KOHMS ±1% 1/4W 1206 ROHS; MFR Part #: RNCP1206FTD1K00CT; Digikey Link: https://www.digikey.com/product-detail/en/RNCP1206FTD1K00/RNCP1206FTD1K00CT-ND/2240675/?itemSeq=304982373; LCSC Part#: C4410; Type: Basic
TP1-TP3 = TP_10x_Probe: Test Point 300 mil centers